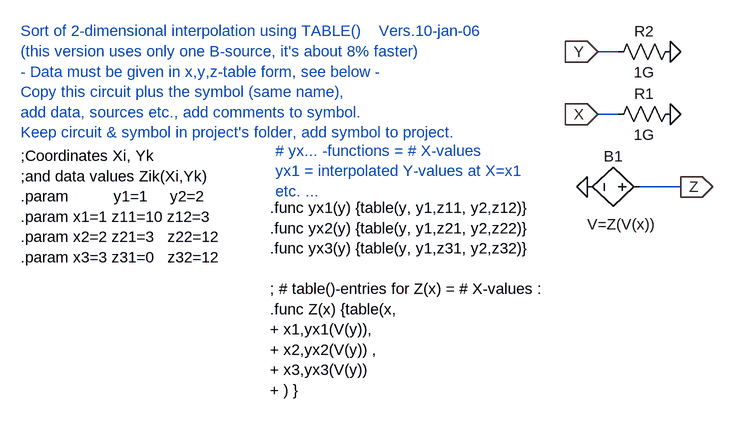
[diagram p0: schematic 2D_Interpolation_Template2.asc]
2D_Interpolation_Template2.asc, the LTspice schematic file:
Version 4
SHEET 1 1612 680
WIRE 752 -224 720 -224
WIRE 752 -128 720 -128
WIRE 848 -16 784 -16
FLAG 704 -16 0
FLAG 848 -16 Z
IOPIN 848 -16 Out
FLAG 720 -128 X
IOPIN 720 -128 In
FLAG 832 -128 0
FLAG 720 -224 Y
IOPIN 720 -224 In
FLAG 832 -224 0
SYMBOL bv 800 -16 R90
WINDOW 3 42 43 VTop 0
WINDOW 0 -32 56 VBottom 0
SYMATTR Value V=Z(V(x))
SYMATTR InstName B1
SYMBOL res 736 -112 R270
WINDOW 0 32 56 VTop 0
WINDOW 3 0 56 VBottom 0
SYMATTR InstName R1
SYMATTR Value 1G
SYMBOL res 736 -208 R270
WINDOW 0 32 56 VTop 0
WINDOW 3 0 56 VBottom 0
SYMATTR InstName R2
SYMATTR Value 1G
TEXT -168 -64 Left 0 !;Coordinates Xi, Yk\n;and data values Zik(Xi,Yk)\n.param          y1=1     y2=2\n.param x1=1 z11=10 z12=3\n.param x2=2 z21=3   z22=12\n.param x3=3 z31=0   z32=12
TEXT -168 -256 Left 0 ;Sort of 2-dimensional interpolation using TABLE()    Vers.10-jan-06\n(this version uses only one B-source, it's about 8% faster)\n- Data must be given in x,y,z-table form, see below -\nCopy this circuit plus the symbol (same name),\nadd data, sources etc., add comments to symbol.\nKeep circuit & symbol in project's folder, add symbol to project.
TEXT 216 16 Left 0 !.func yx1(y) {table(y, y1,z11, y2,z12)}\n.func yx2(y) {table(y, y1,z21, y2,z22)}\n.func yx3(y) {table(y, y1,z31, y2,z32)}\n \n; # table()-entries for Z(x) = # X-values :\n.func Z(x) {table(x,\n+ x1,yx1(V(y)),\n+ x2,yx2(V(y)) ,\n+ x3,yx3(V(y))\n+ ) }
TEXT 224 -72 Left 0 ;# yx... -functions = # X-values\nyx1 = interpolated Y-values at X=x1\netc. ...

The netlist it stands for:
* 2D_Interpolation_Template2.asc
B1 Z 0 V=Z(V(x))
R1 X 0 1G
R2 Y 0 1G
;Coordinates Xi, Yk
;and data values Zik(Xi,Yk)
.param          y1=1     y2=2
.param x1=1 z11=10 z12=3
.param x2=2 z21=3   z22=12
.param x3=3 z31=0   z32=12
* Sort of 2-dimensional interpolation using TABLE()    Vers.10-jan-06
* (this version uses only one B-source, it's about 8% faster)
* - Data must be given in x,y,z-table form, see below -
* Copy this circuit plus the symbol (same name),
* add data, sources etc., add comments to symbol.
* Keep circuit & symbol in project's folder, add symbol to project.
.func yx1(y) {table(y, y1,z11, y2,z12)}
.func yx2(y) {table(y, y1,z21, y2,z22)}
.func yx3(y) {table(y, y1,z31, y2,z32)}
; # table()-entries for Z(x) = # X-values :
.func Z(x) {table(x,
+ x1,yx1(V(y)),
+ x2,yx2(V(y)) ,
+ x3,yx3(V(y))
+ ) }
* # yx... -functions = # X-values
* yx1 = interpolated Y-values at X=x1
* etc. ...
.backanno
.end